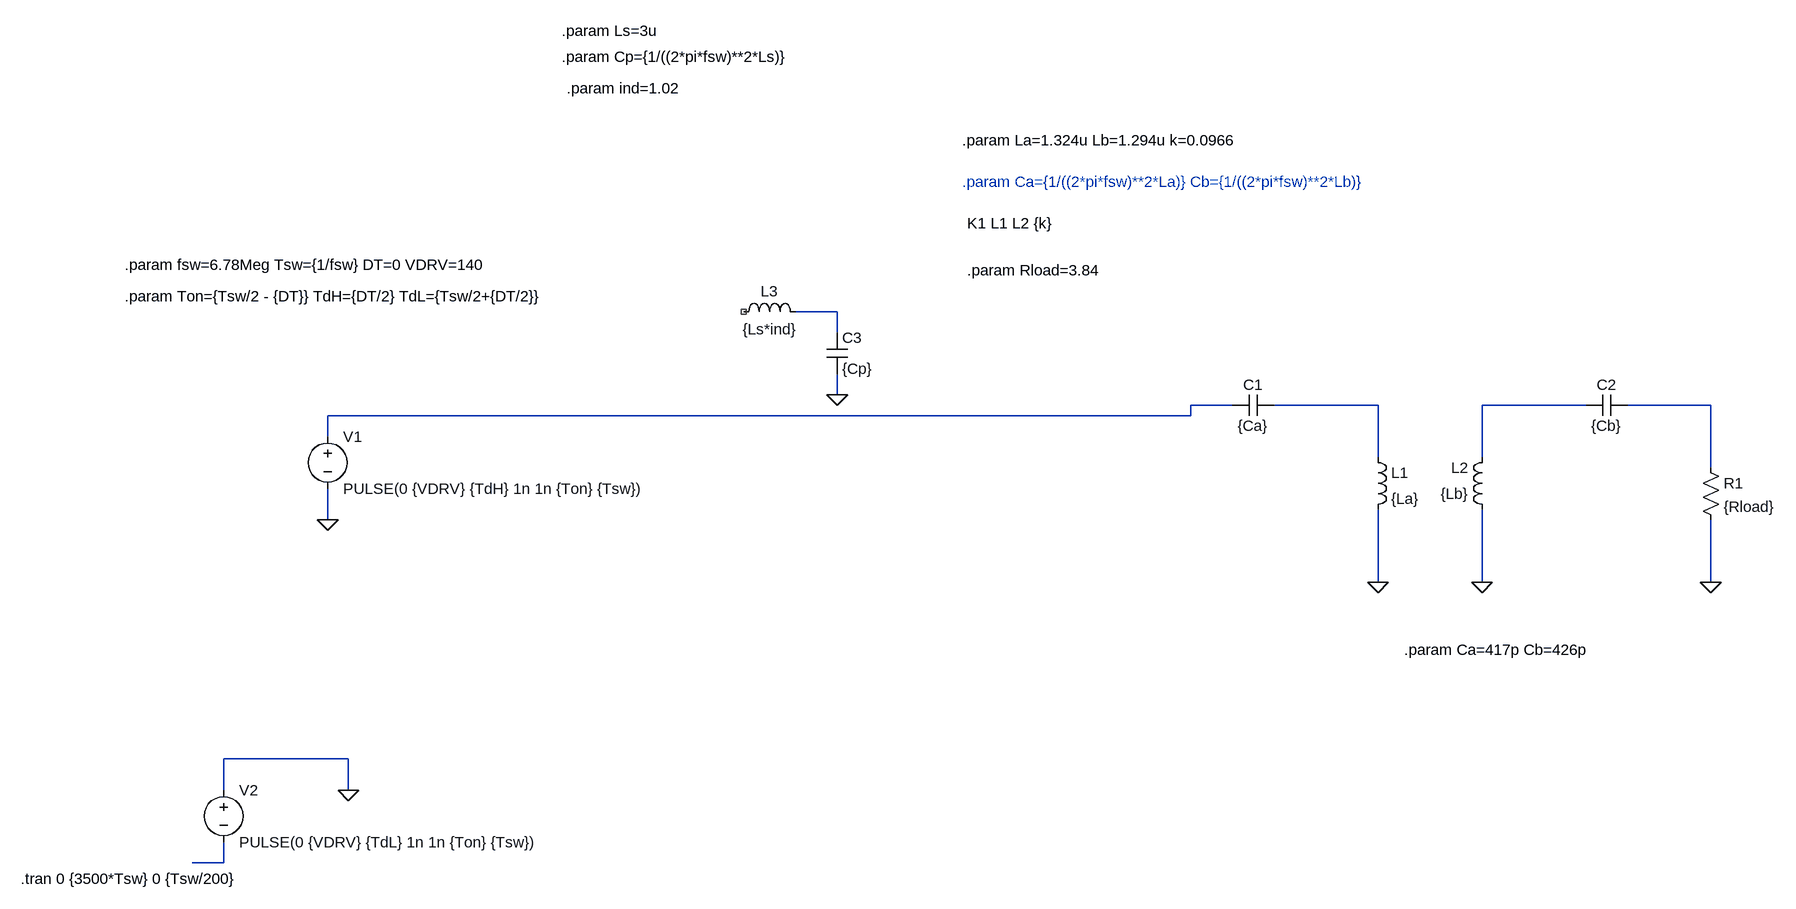
[diagram p0: schematic Draft1.asc]
Draft1.asc, the LTspice schematic file:
Version 4.1
SHEET 1 2292 808
WIRE 832 -80 768 -80
WIRE 832 -48 832 -80
WIRE 832 48 832 16
WIRE 1440 64 1376 64
WIRE 1664 64 1504 64
WIRE 1984 64 1824 64
WIRE 2176 64 2048 64
WIRE 1376 80 1376 64
WIRE 1376 80 48 80
WIRE 48 112 48 80
WIRE 1664 144 1664 64
WIRE 1824 144 1824 64
WIRE 2176 160 2176 64
WIRE 48 240 48 192
WIRE 1664 336 1664 224
WIRE 1824 336 1824 224
WIRE 2176 336 2176 240
WIRE 80 608 -112 608
WIRE -112 656 -112 608
WIRE 80 656 80 608
WIRE -112 768 -112 736
WIRE -112 768 -160 768
FLAG 80 656 0
FLAG 1664 336 0
FLAG 1824 336 0
FLAG 2176 336 0
FLAG 832 48 0
FLAG 48 240 0
SYMBOL voltage 48 96 R0
WINDOW 123 0 0 Left 0
WINDOW 39 0 0 Left 0
SYMATTR InstName V1
SYMATTR Value PULSE(0 {VDRV} {TdH} 1n 1n {Ton} {Tsw})
SYMBOL voltage -112 640 R0
WINDOW 123 0 0 Left 0
WINDOW 39 0 0 Left 0
SYMATTR InstName V2
SYMATTR Value PULSE(0 {VDRV} {TdL} 1n 1n {Ton} {Tsw})
SYMBOL cap 1504 48 R90
WINDOW 0 0 32 VBottom 2
WINDOW 3 32 32 VTop 2
SYMATTR InstName C1
SYMATTR Value {Ca}
SYMBOL ind 1648 128 R0
SYMATTR InstName L1
SYMATTR Value {La}
SYMATTR Type ind
SYMATTR SpiceLine Rser=205m
SYMBOL ind 1840 240 R180
WINDOW 0 36 80 Left 2
WINDOW 3 36 40 Left 2
SYMATTR InstName L2
SYMATTR Value {Lb}
SYMATTR Type ind
SYMATTR SpiceLine Rser=104m
SYMBOL cap 2048 48 R90
WINDOW 0 0 32 VBottom 2
WINDOW 3 32 32 VTop 2
SYMATTR InstName C2
SYMATTR Value {Cb}
SYMBOL res 2160 144 R0
SYMATTR InstName R1
SYMATTR Value {Rload}
SYMBOL ind 672 -64 R270
WINDOW 0 32 56 VTop 2
WINDOW 3 5 56 VBottom 2
SYMATTR InstName L3
SYMATTR Value {Ls*ind}
SYMATTR SpiceLine Rser=10m
SYMBOL cap 816 -48 R0
SYMATTR InstName C3
SYMATTR Value {Cp}
TEXT -264 -152 Left 2 !.param fsw=6.78Meg Tsw={1/fsw} DT=0 VDRV=140
TEXT -264 -104 Left 2 !.param Ton={Tsw/2 - {DT}} TdH={DT/2} TdL={Tsw/2+{DT/2}}
TEXT -424 792 Left 2 !.tran 0 {3500*Tsw} 0 {Tsw/200}
TEXT 1024 -344 Left 2 !.param La=1.324u Lb=1.294u k=0.0966
TEXT 1024 -280 Left 2 ;.param Ca={1/((2*pi*fsw)**2*La)} Cb={1/((2*pi*fsw)**2*Lb)}
TEXT 1032 -216 Left 2 !K1 L1 L2 {k}
TEXT 1032 -144 Left 2 !.param Rload=3.84
TEXT 408 -472 Left 2 !.param Cp={1/((2*pi*fsw)**2*Ls)}
TEXT 408 -512 Left 2 !.param Ls=3u
TEXT 416 -424 Left 2 !.param ind=1.02
TEXT 1704 440 Left 2 !.param Ca=417p Cb=426p

The netlist it stands for:
* Draft1.asc
V1 N002 0 PULSE(0 {VDRV} {TdH} 1n 1n {Ton} {Tsw})
V2 0 N006 PULSE(0 {VDRV} {TdL} 1n 1n {Ton} {Tsw})
C1 N003 N002 {Ca}
L1 N003 0 {La} Rser=205m
L2 0 N004 {Lb} Rser=104m
C2 N005 N004 {Cb}
R1 N005 0 {Rload}
L3 NC_01 N001 {Ls*ind} Rser=10m
C3 N001 0 {Cp}
.param fsw=6.78Meg Tsw={1/fsw} DT=0 VDRV=140
.param Ton={Tsw/2 - {DT}} TdH={DT/2} TdL={Tsw/2+{DT/2}}
.tran 0 {3500*Tsw} 0 {Tsw/200}
.param La=1.324u Lb=1.294u k=0.0966
* .param Ca={1/((2*pi*fsw)**2*La)} Cb={1/((2*pi*fsw)**2*Lb)}
K1 L1 L2 {k}
.param Rload=3.84
.param Cp={1/((2*pi*fsw)**2*Ls)}
.param Ls=3u
.param ind=1.02
.param Ca=417p Cb=426p
.backanno
.end